# Altium schematic sheet Common Source JFET Amplifier.schdoc: Common Source JFET Amplifier
size A4; Organization: Altium Limited; Address1: L3, 12a Rodborough Rd; Address2: Frenchs Forest; Address3: NSW; Address4: Australia 2086; DocumentNumber: 1; SheetNumber: 1; SheetTotal: 1
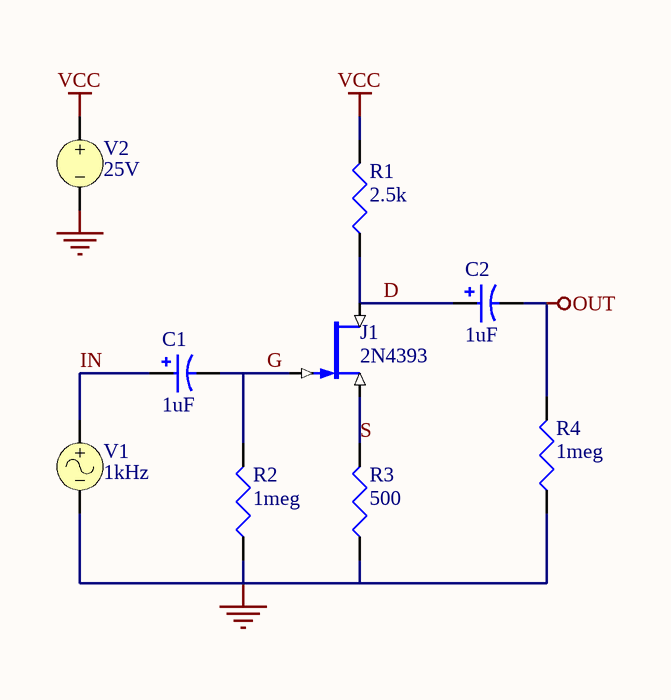
[diagram p0: Common Source JFET Amplifier.schdoc]

## Parts
C1  1uF
C2  1uF
J1  2N4393
R1  2.5k
R2  1meg
R3  500
R4  1meg
V1  1kHz
V2  25V

## Nets
GND: R2.2(BOT) R3.2(BOT) R4.2(BOT) V1.2 V2.2
OUT: C2.2 R4.1(TOP)
VCC: R1.1(TOP) V2.1
D: C2.1 J1.1(D) R1.2(BOT)
G: C1.2 J1.2(G) R2.1(TOP)
IN: C1.1 V1.1
S: J1.3(S) R3.1(TOP)

## Notes on the sheet
- Title
- Size:
- Date:
- A4
- Number:
- Time:
- Revision:
- Sheet
- of
- File:

## Library data of the parts
C1 C2 = CAP2: Bi-Polar Capacitor; Value: 1uF
J1 = 2N4393: N-Channel JFET
R1-R4 = RES: Resistor
  R1: Value: 2.5k
  R2 R4: Value: 1meg
  R3: Value: 500
V1 = VSIN: Sinusoidal Voltage Source
V2 = VSRC: Voltage Source; Value: 25V